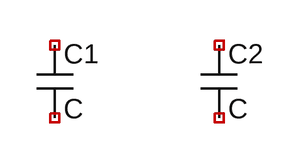
[diagram p0: schematic LTTT Draft2.asc]
LTTT Draft2.asc, the LTspice schematic file:
Version 4
SHEET 1 880 680
SYMBOL cap 80 96 R0
SYMATTR InstName C1
SYMBOL cap 224 96 R0
SYMATTR InstName C2

The netlist it stands for:
* LTTT Draft2.asc
C1 NC_01 NC_02 C
C2 NC_03 NC_04 C
.backanno
.end